# EasyEDA schematic SCH_kyubo_shared_micro_2024-05-23.json
TITLE: Kyubo (Robô Garçom); REV: 3.1; Date: 2024-03-20; Sheet: 1/1; Drawn By: pedromatumoto; Company: Instituto Mauá de Tecnologia
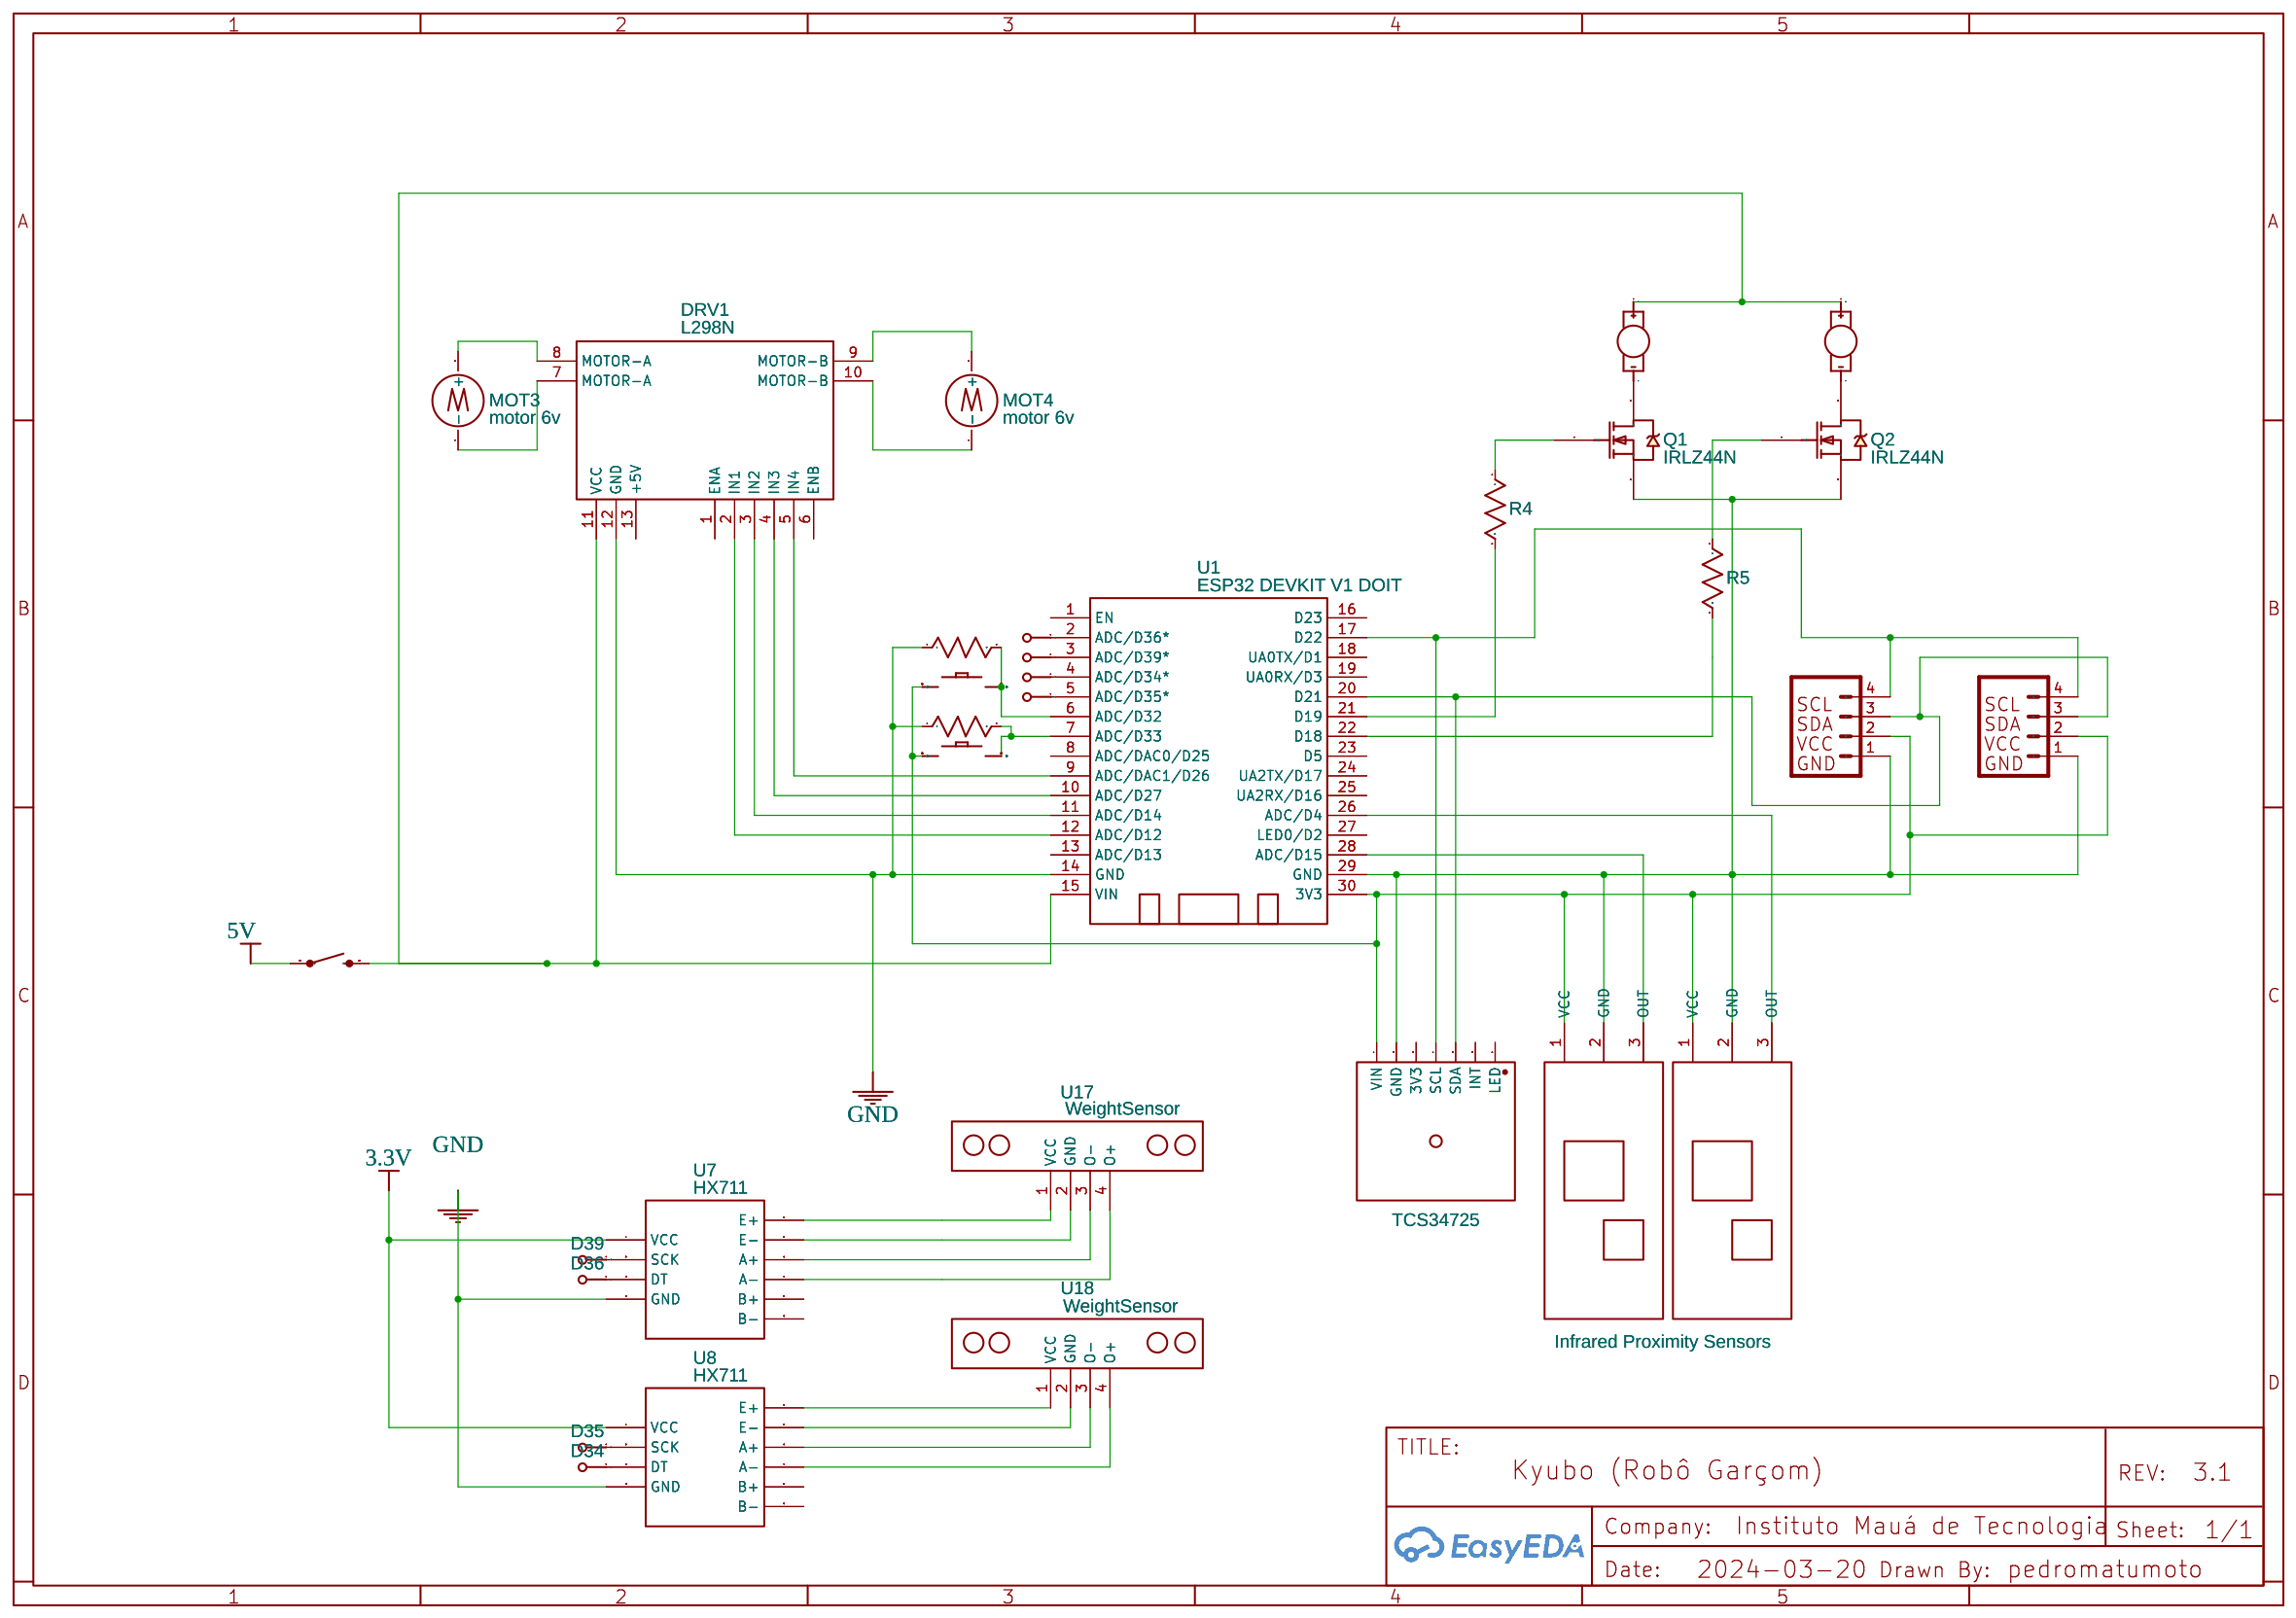
[diagram p0: schematic sheet]

## Parts
1  BUTTON COPY  [32TEETH---CONDUCTIVE-BUTTONS_CONDUCTIVE_BUTTON_DIRECTIONAL_THICK]
2  BUTTON COPY  [32TEETH---CONDUCTIVE-BUTTONS_CONDUCTIVE_BUTTON_DIRECTIONAL_THICK]
DRV1  L298N  [L298N]
JP1  I2C_STANDARD_NO_SILK  [1X04_NO_SILK]
JP2  I2C_STANDARD_NO_SILK  [1X04_NO_SILK]
MOT3  motor 6v  [VIBRATION MOTOR - 3V COIN TYPE VIBRATION MOTOR 10000RPM]
MOT4  motor 6v  [VIBRATION MOTOR - 3V COIN TYPE VIBRATION MOTOR 10000RPM]
Q1  IRLZ44N  [TO-220AB]
Q2  IRLZ44N  [TO-220AB]
R1  1k  [R0603]
R2  1k  [R0603]
R4  1k  [R0603]
R5  1k  [R0603]
S1  SWITCH-MOMENTARY  [SWITCH-RIGHT-ANGLE]
U1  ESP32 DEVKIT V1 DOIT  [DOIT-ESP32-DEVKIT-V1]
U2  MOTOR10MM  [VIBE-MOTOR-10MM]
U3  MOTOR10MM  [VIBE-MOTOR-10MM]
U4  TCS34725
U5  Infrared Proximity Sensors  [INFRARED PROXIMITY SENSOR]
U6  Infrared Proximity Sensor  [INFRARED PROXIMITY SENSOR]
U7  HX711
U8  HX711
U9  OUTPUT2 COPY
U10  OUTPUT2 COPY
U11  D39
U12  D36
U13  OUTPUT2 COPY
U14  OUTPUT2 COPY
U15  D35
U16  D34
U17  WeightSensor
U18  WeightSensor

## Library data of the parts
1 2 = BUTTON COPY: Contributor: LorenzoVonMatterhorn
DRV1 = L298N: Contributor: khanhtan
JP1 JP2 = I2C_STANDARD_NO_SILK: SparkFun has standardized on a pinout for all I2C based sensor breakouts.; Contributor: SparkFun
MOT3 MOT4 = motor 24v: Supplier: LCSC; Supplier Part: C2759984; Manufacturer: LEADER(立得); Manufacturer Part: LCM1027A2445F; JLCPCB Part Class: Extended Part; Contributor: Oscar Reyes M
Q1 Q2 = IRLZ44N: HEXFET Power MOSFET
R1 R2 R4 R5 = R_0603_US: Contributor: LCEDA_Lib
S1 = SWITCH-MOMENTARY: Contributor: Pinoccio
U1 = ESP32 DEVKIT V1 DOIT: Contributor: ConceitoTeam
U2 U3 = MOTOR10MM: Vibration Motor- ROB-08449; Contributor: SparkFun
U4 = TCS34725: catid: 20; Contributor: 20-07540; sim: true
U5 U6 = Infrared Proximity Sensor: Contributor: kirkdelluba18
U7 U8 = HX711: catid: 20; Contributor: adrielgff
U9-U16 = OUTPUT2 COPY: catid: 20; Contributor: kavurase; sim: true
U17 U18 = WeightSensor: Manufacturer Part: New SchematicLib; Contributor: prajval kumar.c supernova

## Nets
3.3V: U7.7(VCC) U8.7(VCC)
5V: S1.P$1(1)
GND: DRV1.12(GND) R1.1 R2.1 U1.14(GND) U7.10(GND) U8.10(GND)
Net-(1-P$ACTIVE): 1.P$ACTIVE R1.2 U1.7(ADC/D33)
Net-(1-P$GND): 1.P$GND 2.P$GND JP1.2 JP2.2 U1.30(3V3) U4.7(VIN) U5.1(VCC) U6.1(VCC)
Net-(2-P$ACTIVE): 2.P$ACTIVE R2.2 U1.6(ADC/D32)
Net-(DRV1-2): DRV1.2(IN1) U1.12(ADC/D12)
Net-(DRV1-3): DRV1.3(IN2) U1.11(ADC/D14)
Net-(DRV1-4): DRV1.4(IN3) U1.10(ADC/D27)
Net-(DRV1-5): DRV1.5(IN4) U1.9(ADC/DAC1/D26)
Net-(DRV1-7): DRV1.7(MOTOR-A) MOT3.1(-)
Net-(DRV1-8): DRV1.8(MOTOR-A) MOT3.2(+)
Net-(DRV1-9): DRV1.9(MOTOR-B) MOT4.2(+)
Net-(DRV1-10): DRV1.10(MOTOR-B) MOT4.1(-)
Net-(DRV1-11): DRV1.11(VCC) S1.P$2(2) U1.15(VIN) U2.+ U3.+
Net-(JP1-1): JP1.1 JP2.1 Q1.3(S) Q2.3(S) U1.29(GND) U4.6(GND) U5.2(GND) U6.2(GND)
Net-(JP1-3): JP1.3 JP2.3 U1.20(D21) U4.3(SDA)
Net-(JP1-4): JP1.4 JP2.4 U1.17(D22) U4.4(SCL)
Net-(Q1-1): Q1.1(G) R4.1
Net-(Q1-2): Q1.2(D) U2.-
Net-(Q2-1): Q2.1(G) R5.1
Net-(Q2-2): Q2.2(D) U3.-
Net-(R4-2): R4.2 U1.21(D19)
Net-(R5-2): R5.2 U1.22(D18)
Net-(U1-2): U1.2(ADC/D36*) U10.1
Net-(U1-3): U1.3(ADC/D39*) U9.1
Net-(U1-4): U1.4(ADC/D34*) U13.1
Net-(U1-5): U1.5(ADC/D35*) U14.1
Net-(U1-26): U1.26(ADC/D4) U6.3(OUT)
Net-(U1-28): U1.28(ADC/D15) U5.3(OUT)
Net-(U7-1): U7.1(E+) U17.1(VCC)
Net-(U7-2): U7.2(E-) U17.2(GND)
Net-(U7-3): U7.3(A+) U17.3(O-)
Net-(U7-4): U7.4(A-) U17.4(O+)
Net-(U7-8): U7.8(SCK) U11.1
Net-(U7-9): U7.9(DT) U12.1
Net-(U8-1): U8.1(E+) U18.1(VCC)
Net-(U8-2): U8.2(E-) U18.2(GND)
Net-(U8-3): U8.3(A+) U18.3(O-)
Net-(U8-4): U8.4(A-) U18.4(O+)
Net-(U8-8): U8.8(SCK) U15.1
Net-(U8-9): U8.9(DT) U16.1

Not connected (* = marked no-connect by the designer): DRV1 1(ENA) 6(ENB) 13(+5V); U1 1(EN) 8(ADC/DAC0/D25) 13(ADC/D13) 16(D23) 18(UA0TX/D1) 19(UA0RX/D3) 23(D5) 24(UA2TX/D17) 25(UA2RX/D16) 27(LED0/D2); U4 1(LED) 2(INT) 5(3V3); U7 5(B+) 6(B-); U8 5(B+) 6(B-)
